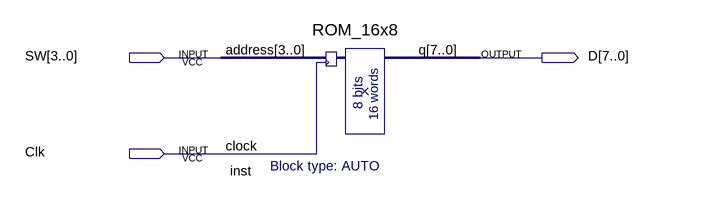
[diagram p0: schematic sheet]
// Quartus schematic ROM.bdf as structural Verilog: 1 symbols, 3 pins
module ROM (
  input  [3:0] SW,
  input  Clk,
  output [7:0] D
);

  ROM_16x8 inst (.address(SW), .clock(Clk), .q(D));
endmodule
